# Altium project MainBoard.PrjPCB
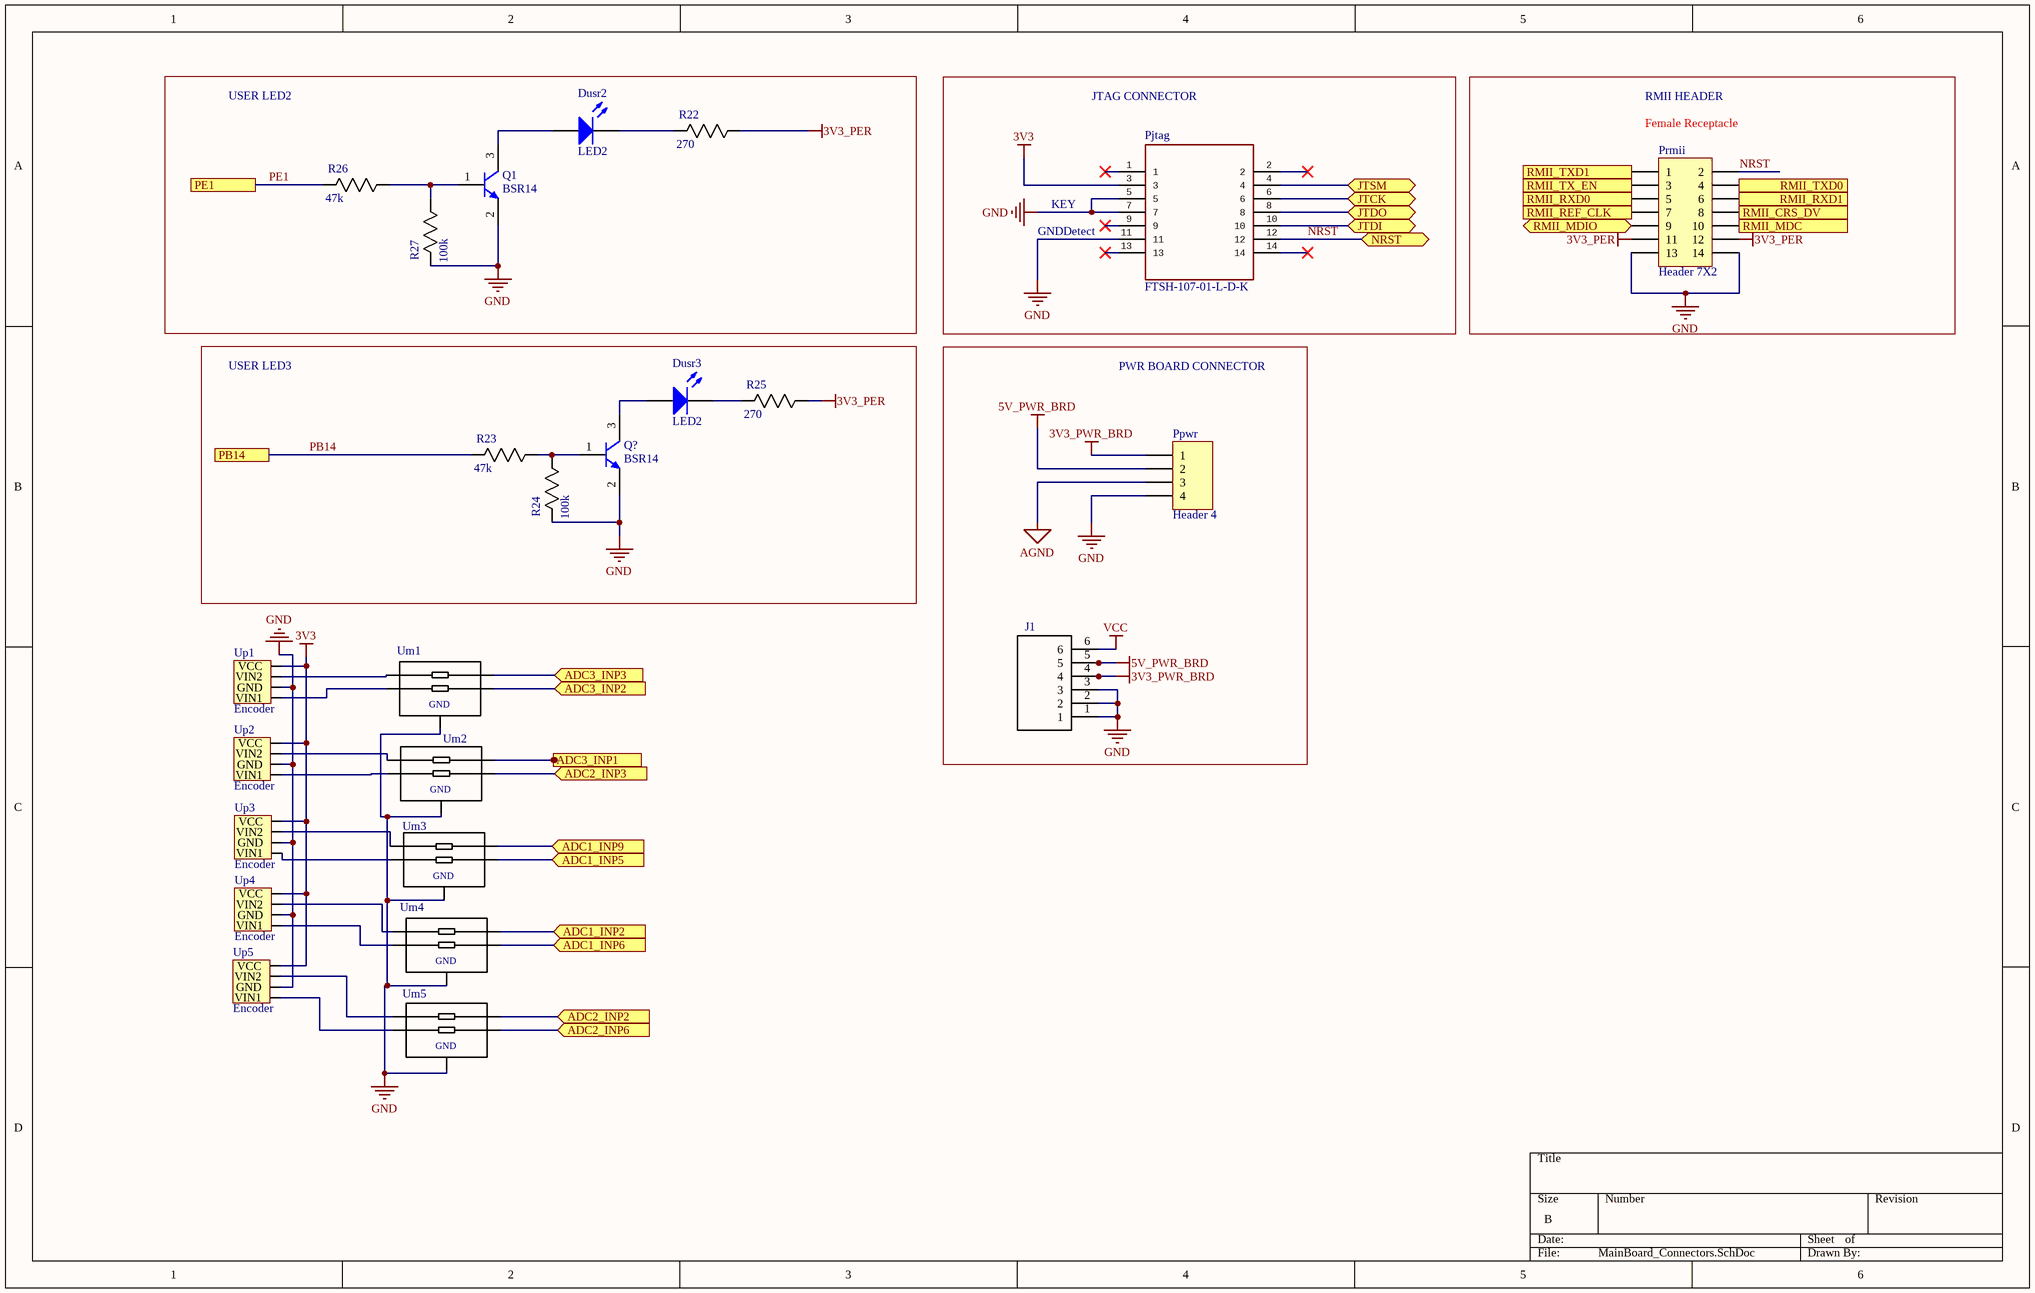
[diagram p0: MainBoard_Connectors.SchDoc]
5 sheets, 105 parts. Net scope: flat (ports and power ports of the same name join across sheets).
Board file: MainBoard.PcbDoc
Sheets:
  MainBoard_Connectors.SchDoc
  MainBoard_Top.SchDoc
    U_MCUIOs = MainBoard_144_IOs.SchDoc
    U_MCU_PWR = MainBoard_MCU_PWR.SchDoc
  MainBoard_USB.SchDoc

## Sheet MainBoard_Connectors.SchDoc
size B

### Parts
Dusr2  LED2  [3.2X1.6X1.1]
Dusr3  LED2  [3.2X1.6X1.1]
J1  CN HEADER VERT 6POS 3.96MM  [CN HDR 6POS 3.96MM]  (value not drawn)
Pjtag  FTSH-107-01-L-D-K  [CN HDR JTAG]
Ppwr  Header 4  [HDR1X4]
Prmii  Header 7X2  [HDR2X7]
Q1  BSR14  [ONSC-SOT-23-3-318-08_V]
Q?  BSR14  [ONSC-SOT-23-3-318-08_V]
R22  270  [0805]
R23  47k  [0805]
R24  100k  [0805]
R25  270  [0805]
R26  47k  [0805]
R27  100k  [0805]
Um1  EMI  [SOT-665]  (value not drawn)
Um2  EMI  [SOT-665]  (value not drawn)
Um3  EMI  [SOT-665]  (value not drawn)
Um4  EMI  [SOT-665]  (value not drawn)
Um5  EMI  [SOT-665]  (value not drawn)
Up1  Encoder  [EncoderConnector]
Up2  Encoder  [EncoderConnector]
Up3  Encoder  [EncoderConnector]
Up4  Encoder  [EncoderConnector]
Up5  Encoder  [EncoderConnector]

### Blocks framed on the sheet
USER LED2: Dusr2 Q1 R22 R26 R27
USER LED3: Dusr3 Q? R23-R25
PWR BOARD CONNECTOR: J1 Ppwr

### Ports
ADC1_INP2 (in), ADC1_INP5 (in), ADC1_INP6 (in), ADC1_INP9 (in), ADC2_INP2 (in), ADC2_INP3 (in), ADC2_INP6 (in), ADC3_INP1 (in), ADC3_INP2 (in), ADC3_INP3 (in), JTCK (bidir), JTDI (bidir), JTDO (bidir), JTSM (bidir), NRST (bidir), PB14, PE1, RMII_CRS_DV (out), RMII_MDC (in), RMII_MDIO (bidir), RMII_REF_CLK (in), RMII_RXD0 (out), RMII_RXD1 (out), RMII_TX_EN (in), RMII_TXD0 (in), RMII_TXD1 (in)

### Nets
3V3: Pjtag.3 Up1.VCC Up2.VCC Up3.VCC Up4.VCC Up5.VCC
3V3_PER: Prmii.11 Prmii.12 R22.1(R1) R25.1(R1)
3V3_PWR_BRD: J1.4 Ppwr.1
5V_PWR_BRD: J1.5 Ppwr.2
AGND: Ppwr.3
GND: J1.1 J1.2 J1.3 Pjtag.5 Pjtag.7 Pjtag.11 Ppwr.4 Prmii.13 Prmii.14 Q1.2(E) Q?.2(E) R24.2(R2) R27.2(R2) Um1.2(P$2) Um2.2(P$2) Um3.2(P$2) Um4.2(P$2) Um5.2(P$2) Up1.GND Up2.GND Up3.GND Up4.GND Up5.GND
VCC: J1.6
ADC1_INP2: Um4.5(P$5) ; port ADC1_INP2
ADC1_INP5: Um3.4(P$4) ; port ADC1_INP5
ADC1_INP6: Um4.4(P$4) ; port ADC1_INP6
ADC1_INP9: Um3.5(P$5) ; port ADC1_INP9
ADC2_INP2: Um5.5(P$5) ; port ADC2_INP2
ADC2_INP3: Um2.4(P$4) ; port ADC2_INP3
ADC2_INP6: Um5.4(P$4) ; port ADC2_INP6
ADC3_INP1: Um2.5(P$5) ; port ADC3_INP1
ADC3_INP2: Um1.4(P$4) ; port ADC3_INP2
ADC3_INP3: Um1.5(P$5) ; port ADC3_INP3
ETH_CRS_DV: Prmii.8 ; port RMII_CRS_DV
ETH_MDC: Prmii.10 ; port RMII_MDC
ETH_MDIO: Prmii.9 ; port RMII_MDIO
ETH_REF_CLK: Prmii.7 ; port RMII_REF_CLK
ETH_RXD0: Prmii.5 ; port RMII_RXD0
ETH_RXD1: Prmii.6 ; port RMII_RXD1
ETH_TX_EN: Prmii.3 ; port RMII_TX_EN
ETH_TXD0: Prmii.4 ; port RMII_TXD0
ETH_TXD1: Prmii.1 ; port RMII_TXD1
JTCK-SWCLK: Pjtag.6 ; port JTCK
JTDI: Pjtag.10 ; port JTDI
JTDO_SWO: Pjtag.8 ; port JTDO
NRST: Pjtag.12 Prmii.2 ; port NRST
PB14: R23.2(R2) ; port PB14
PE1: R26.2(R2) ; port PE1
NetDusr2_1: Dusr2.1(A) Q1.3(C)
NetDusr2_2: Dusr2.2(K) R22.2(R2)
NetDusr3_1: Dusr3.1(A) Q?.3(C)
NetDusr3_2: Dusr3.2(K) R25.2(R2)
NetPjtag_4: Pjtag.4 ; port JTSM
NetQ1_1: Q1.1(B) R26.1(R1) R27.1(R1)
NetQ?_1: Q?.1(B) R23.1(R1) R24.1(R1)
NetUm1_1: Um1.1(P$1) Up1.VIN2
NetUm1_3: Um1.3(P$3) Up1.VIN1
NetUm2_1: Um2.1(P$1) Up2.VIN2
NetUm2_3: Um2.3(P$3) Up2.VIN1
NetUm3_1: Um3.1(P$1) Up3.VIN2
NetUm3_3: Um3.3(P$3) Up3.VIN1
NetUm4_1: Um4.1(P$1) Up4.VIN2
NetUm4_3: Um4.3(P$3) Up4.VIN1
NetUm5_1: Um5.1(P$1) Up5.VIN2
NetUm5_3: Um5.3(P$3) Up5.VIN1

Not connected (* = marked no-connect by the designer): Pjtag 1* 2* 9* 13* 14*

### Notes on the sheet
- JTAG CONNECTOR
- RMII HEADER
- (near Prmii) Female Receptacle
- (near Pjtag) GNDDetect
- KEY
- (in symbol IP4256CZ5-W) GND

### Library data of the parts
Dusr2 = LED GREEN SMD: Typical RED, GREEN, YELLOW, AMBER GaAs LED; MF: Lite-On Inc.; MP: LTST-C191KGKT; Rating: 2V; Digikey: 160-1446-1-ND; Digikey Link: https://www.digikey.ca/products/en?keywords=160-1446-1-ND; Package: 0603
Dusr3 = LED RED SMD: Typical RED, GREEN, YELLOW, AMBER GaAs LED; MF: Lite-On Inc.; MP: LTST-C190CKT; Rating: 1.8V; Digikey: 160-1181-1-ND; Digikey Link: https://www.digikey.ca/products/en?keywords=160-1181-1-ND; Package: 0603
J1 = CN HDR VERT 6POS 3.96MM: Connector Header Through Hole 6 position 0.156" (3.96mm); MF: TE Connectivity; MP: 1877285-6; Current Rating: 7.5A; Voltage Rating: 250VAC; SnapEDA_Link: https://www.snapeda.com/parts/1877285-6/TE%20Connectivity/view-part/2371244/?ref=snap; Digikey: A99849-ND; Digikey Link: https://www.digikey.ca/product-detail/en/te-connectivity-amp-connectors/1877285-6/A99849-ND/2000097
Pjtag = CN HDR JTAG: Connector Header Through Hole 14 position 0.050" (1.27mm); MF: Samtec Inc.; Rating: 3.4A; ComponentLink1Description: Digikey; ComponentLink1URL: https://www.digikey.ca/product-detail/en/samtec-inc/FTSH-107-01-L-D-K/612-FTSH-107-01-L-D-K-ND/6693516; ComponentLink2Description: Datasheet; ComponentLink2URL: https://www.digikey.ca/en/datasheets/samtecinc/samtec-inc-ftsh-1xx-xx-xx-d-xx-xx-mkt; Digikey: 612-FTSH-107-01-L-D-K-ND; Digikey Link: https://www.digikey.ca/product-detail/en/samtec-inc/FTSH-107-01-L-D-K/612-FTSH-107-01-L-D-K-ND/6693516; MP: FTSH-107-01-L-D-K; Price: 5.14000 CAD
Ppwr = Header 4: Header, 4-Pin; LatestRevisionDate: 17-Jul-2002; LatestRevisionNote: Re-released for DXP Platform.; Publisher: Altium Limited
Prmii = Header 7X2: Header, 7-Pin, Dual row; LatestRevisionDate: 17-Jul-2002; LatestRevisionNote: Re-released for DXP Platform.; Publisher: Altium Limited
Q1 Q? = CMP-1048-00605-1: Bipolar (BJT) Transistor NPN 40V 800mA 300MHz 350mW Surface Mount SOT-23-3; ComponentLink1Description: Manufacturer URL; ComponentLink3Description: Package Specification; ComponentLink2URL: http://www.onsemi.com/pub_link/Collateral/BSS64LT1-D.PDF; ComponentLink1URL: http://www.onsemi.com/; ComponentLink2Description: Datasheet; ComponentLink3URL: http://www.onsemi.cn/pub_link/Collateral/318-08.PDF; Digikey: BSR14TR-ND
R22 R25 = RES 270 0805: RES SMD 270 OHM 5% 1/8W 0805; MP: RC0805JR-07270RL; MF: Yageo; Rating: 0.125W; Digikey: 311-270ARCT-ND; Price: 0.054 CAD; Package: 0805; Value: 270; Digikey Link: https://www.digikey.ca/product-detail/en/yageo/RC0805JR-07270RL/311-270ARCT-ND/731238
R23 R26 = RES 47k 0805: RES SMD 47K OHM 1% 1/8W 0805; MP: RC0805FR-0747KL; MF: Yageo; Rating: 0.125W; Digikey: 311-47.0KCRCT-ND; Price: 0.061 CAD; Package: 0805; Value: 47k; Digikey Link: https://www.digikey.ca/product-detail/en/yageo/RC0805FR-0747KL/311-47.0KCRCT-ND/730920; Tolerance: 1%
R24 R27 = RES 100k 0805: RES SMD 100K OHM 1% 1/8W 0805; MP: RC0805FR-07100KL; MF: Yageo; Rating: 0.125W; Digikey: 311-100KCRCT-ND; Price: 0.058 CAD; Package: 0805; Value: 100k; Digikey Link: https://www.digikey.ca/products/en?keywords=311-100KCRCT-ND; Tolerance: 1%
Um1-Um5 = IP4256CZ5-W: RC (Pi) EMI Filter 2nd Order Low Pass 2 Channel R = 100Ohms, C = 19pF (Total)  SOT-665; MF: Nexperia USA Inc.; MP: IP4256CZ5-W,115; SnapEDA_Link: https://www.snapeda.com/parts/IP4256CZ5-W/Nexperia%20USA%20Inc./view-part/3605439/?ref=snap; Price: 0.17 CAD; Package: SOT-665; Digikey: 1727-4718-1-ND; Digikey Link: https://www.digikey.ca/product-detail/en/nexperia-usa-inc/IP4256CZ5-W115/1727-4718-1-ND/2531158
Up1-Up5 = Encoder Connector: CONN HEADER R/A 4POS 1.5MM; MF: JST Sales America Inc.; MP: S4B-ZR(LF)(SN); Rating: 1A; Digikey: 455-1671-ND; Digikey Link: https://www.digikey.ca/products/en?keywords=455-1671-ND; Price: 0.324 CAD; Package: N/A; Value: N/A

## Sheet MainBoard_Top.SchDoc
size A
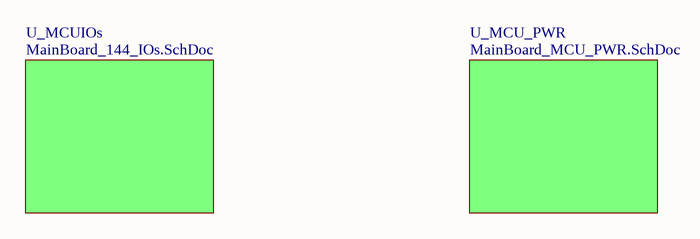
[diagram p1: MainBoard_Top.SchDoc]

### Sub-sheets
U_MCU_PWR = MainBoard_MCU_PWR.SchDoc: no entries
U_MCUIOs = MainBoard_144_IOs.SchDoc: no entries

## Sheet MainBoard_144_IOs.SchDoc
size B
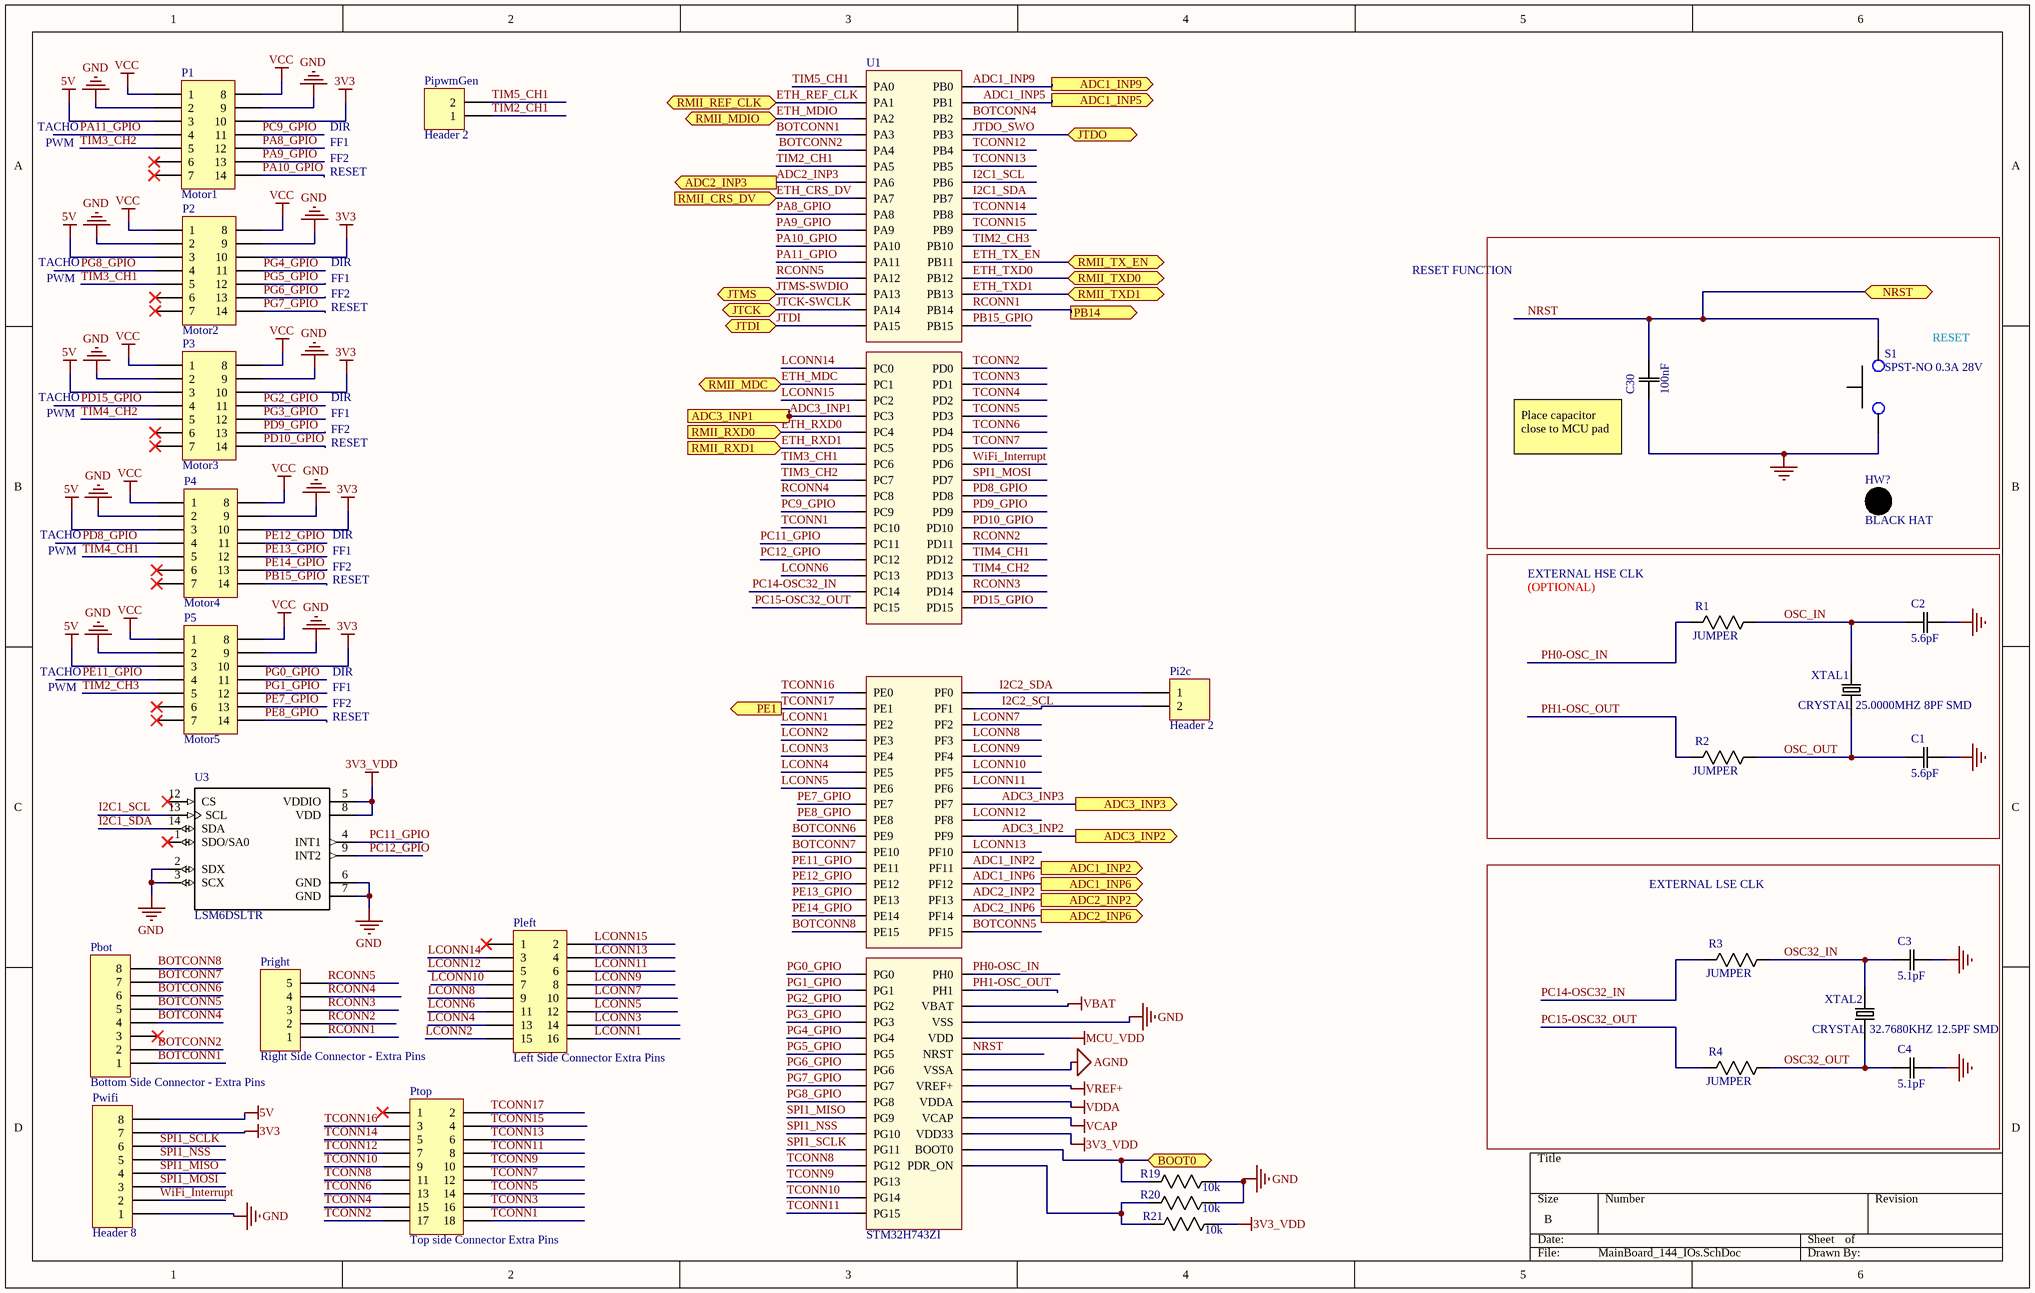
[diagram p2: MainBoard_144_IOs.SchDoc]

### Parts
C1  5.6pF  [0805]
C2  5.6pF  [0805]
C3  5.1pF  [0805]
C4  5.1pF  [0805]
C30  100nF  [0805]
HW?  value BLACK HAT  (hidden comment: BUTTON_HAT_BLACK)  (mechanical)
P1  Motor1  [HDR2X7_CEN]
P2  Motor2  [HDR2X7_CEN]
P3  Motor3  [HDR2X7_CEN]
P4  Motor4  [HDR2X7_CEN]
P5  Motor5  [HDR2X7_CEN]
Pbot  Bottom Side Connector - Extra Pins  [HDR1X8]
Pi2c  Header 2  [HDR1X2]
PipwmGen  Header 2  [HDR1X2]
Pleft  Left Side Connector Extra Pins  [HDR2X8]
Pright  Right Side Connector - Extra Pins  [HDR1X5]
Ptop  Top side Connector Extra Pins  [HDR2X9]
Pwifi  Header 8  [HDR1X8]
R1  JUMPER  [0805]
R2  JUMPER  [0805]
R3  JUMPER  [0805]
R4  JUMPER  [0805]
R19  10k  [0805]
R20  10k  [0805]
R21  10k  [0805]
S1  SPST-NO 0.3A 28V  [PB300STQ]
U1  STM32H743ZI  [STM32H7]
U3  LSM6DSLTR  [LGA-14]
XTAL1  CRYSTAL 25.0000MHZ 8PF SMD  [SMD-2]
XTAL2  CRYSTAL 32.7680KHZ 12.5PF SMD  [SMD-2]

### Blocks framed on the sheet
EXTERNAL LSE CLK: C3 C4 R3 R4 XTAL2

### Ports
ADC1_INP2 (out), ADC1_INP5 (out), ADC1_INP6 (out), ADC1_INP9 (out), ADC2_INP2 (out), ADC2_INP3 (out), ADC2_INP6 (out), ADC3_INP1 (out), ADC3_INP2 (out), ADC3_INP3 (out), BOOT0 (bidir), JTCK (bidir), JTDI (bidir), JTDO (bidir), JTMS (bidir), NRST (bidir), PB14 (out), PE1 (out), RMII_CRS_DV (in), RMII_MDC (bidir), RMII_MDIO (bidir), RMII_REF_CLK (bidir), RMII_RXD0 (in), RMII_RXD1 (in), RMII_TX_EN (bidir), RMII_TXD0 (bidir), RMII_TXD1 (bidir)

### Nets
3V3: P1.10 P2.10 P3.10 P4.10 P5.10 Pwifi.7
3V3_VDD: R21.1(R1) U1.VDD33USB(VDD33) U3.5(VDDIO) U3.8(VDD)
5V: P1.3 P2.3 P3.3 P4.3 P5.3 Pwifi.8
AGND: U1.VSSA
GND: C1.2(C2) C2.2(C2) C3.2(C2) C4.2(C2) C30.1(C1) P1.2 P1.9 P2.2 P2.9 P3.2 P3.9 P4.2 P4.9 P5.2 P5.9 Pwifi.1 R19.1(R1) R20.1(R1) S1.1 U1.VSS U3.2(SDX) U3.3(SCX) U3.6(GND) U3.7(GND)
MCU_VDD: U1.VDD
VBAT: U1.VBAT
VCAP: U1.VCAP
VCC: P1.1 P1.8 P2.1 P2.8 P3.1 P3.8 P4.1 P4.8 P5.1 P5.8
VDDA: U1.VDDA
VREF+: U1.VREF+
ADC1_INP2: U1.PF11 ; port ADC1_INP2
ADC1_INP5: U1.PB1 ; port ADC1_INP5
ADC1_INP6: U1.PF12 ; port ADC1_INP6
ADC1_INP9: U1.PB0 ; port ADC1_INP9
ADC2_INP2: U1.PF13 ; port ADC2_INP2
ADC2_INP3: U1.PA6 ; port ADC2_INP3
ADC2_INP6: U1.PF14 ; port ADC2_INP6
ADC3_INP1: U1.PC3 ; port ADC3_INP1
ADC3_INP2: U1.PF9 ; port ADC3_INP2
ADC3_INP3: U1.PF7 ; port ADC3_INP3
BOTCONN1: Pbot.1 U1.PA3
BOTCONN2: Pbot.2 U1.PA4
BOTCONN4: Pbot.4 U1.PB2
BOTCONN5: Pbot.5 U1.PF15
BOTCONN6: Pbot.6 U1.PE9
BOTCONN7: Pbot.7 U1.PE10
BOTCONN8: Pbot.8 U1.PE15
ETH_CRS_DV: U1.PA7 ; port RMII_CRS_DV
ETH_MDC: U1.PC1 ; port RMII_MDC
ETH_MDIO: U1.PA2 ; port RMII_MDIO
ETH_REF_CLK: U1.PA1 ; port RMII_REF_CLK
ETH_RXD0: U1.PC4 ; port RMII_RXD0
ETH_RXD1: U1.PC5 ; port RMII_RXD1
ETH_TX_EN: U1.PB11 ; port RMII_TX_EN
ETH_TXD0: U1.PB12 ; port RMII_TXD0
ETH_TXD1: U1.PB13 ; port RMII_TXD1
I2C1_SCL: U1.PB6 U3.13(SCL)
I2C1_SDA: U1.PB7 U3.14(SDA)
I2C2_SCL: Pi2c.2 U1.PF1
I2C2_SDA: Pi2c.1 U1.PF0
JTCK-SWCLK: U1.PA14 ; port JTCK
JTDI: U1.PA15 ; port JTDI
JTDO_SWO: U1.PB3 ; port JTDO
JTMS-SWDIO: U1.PA13 ; port JTMS
LCONN1: Pleft.16 U1.PE2
LCONN2: Pleft.15 U1.PE3
LCONN3: Pleft.14 U1.PE4
LCONN4: Pleft.13 U1.PE5
LCONN5: Pleft.12 U1.PE6
LCONN6: Pleft.11 U1.PC13
LCONN7: Pleft.10 U1.PF2
LCONN8: Pleft.9 U1.PF3
LCONN9: Pleft.8 U1.PF4
LCONN10: Pleft.7 U1.PF5
LCONN11: Pleft.6 U1.PF6
LCONN12: Pleft.5 U1.PF8
LCONN13: Pleft.4 U1.PF10
LCONN14: Pleft.3 U1.PC0
LCONN15: Pleft.2 U1.PC2
NRST: C30.2(C2) S1.2 U1.NRST ; port NRST
OSC32_IN: C3.1(C1) R3.1(R1) XTAL2.2
OSC32_OUT: C4.1(C1) R4.1(R1) XTAL2.1
OSC_IN: C2.1(C1) R1.1(R1) XTAL1.2
OSC_OUT: C1.1(C1) R2.1(R1) XTAL1.1
PA8_GPIO: P1.12 U1.PA8
PA9_GPIO: P1.13 U1.PA9
PA10_GPIO: P1.14 U1.PA10
PA11_GPIO: P1.4 U1.PA11
PB15_GPIO: P4.14 U1.PB15
PC9_GPIO: P1.11 U1.PC9
PC11_GPIO: U1.PC11 U3.4(INT1)
PC12_GPIO: U1.PC12 U3.9(INT2)
PC14-OSC32_IN: R3.2(R2) U1.PC14
PC15-OSC32_OUT: R4.2(R2) U1.PC15
PD8_GPIO: P4.4 U1.PD8
PD9_GPIO: P3.13 U1.PD9
PD10_GPIO: P3.14 U1.PD10
PD15_GPIO: P3.4 U1.PD15
PE7_GPIO: P5.13 U1.PE7
PE8_GPIO: P5.14 U1.PE8
PE11_GPIO: P5.4 U1.PE11
PE12_GPIO: P4.11 U1.PE12
PE13_GPIO: P4.12 U1.PE13
PE14_GPIO: P4.13 U1.PE14
PG0_GPIO: P5.11 U1.PG0
PG1_GPIO: P5.12 U1.PG1
PG2_GPIO: P3.11 U1.PG2
PG3_GPIO: P3.12 U1.PG3
PG4_GPIO: P2.11 U1.PG4
PG5_GPIO: P2.12 U1.PG5
PG6_GPIO: P2.13 U1.PG6
PG7_GPIO: P2.14 U1.PG7
PG8_GPIO: P2.4 U1.PG8
PH0-OSC_IN: R1.2(R2) U1.PH0
PH1-OSC_OUT: R2.2(R2) U1.PH1
RCONN1: Pright.1 U1.PB14 ; port PB14  [project net PB14]
RCONN2: Pright.2 U1.PD11
RCONN3: Pright.3 U1.PD14
RCONN4: Pright.4 U1.PC8
RCONN5: Pright.5 U1.PA12
SPI1_MISO: Pwifi.4 U1.PG9
SPI1_MOSI: Pwifi.3 U1.PD7
SPI1_NSS: Pwifi.5 U1.PG10
SPI1_SCLK: Pwifi.6 U1.PG11
TCONN1: Ptop.18 U1.PC10
TCONN2: Ptop.17 U1.PD0
TCONN3: Ptop.16 U1.PD1
TCONN4: Ptop.15 U1.PD2
TCONN5: Ptop.14 U1.PD3
TCONN6: Ptop.13 U1.PD4
TCONN7: Ptop.12 U1.PD5
TCONN8: Ptop.11 U1.PG12
TCONN9: Ptop.10 U1.PG13
TCONN10: Ptop.9 U1.PG14
TCONN11: Ptop.8 U1.PG15
TCONN12: Ptop.7 U1.PB4
TCONN13: Ptop.6 U1.PB5
TCONN14: Ptop.5 U1.PB8
TCONN15: Ptop.4 U1.PB9
TCONN16: Ptop.3 U1.PE0
TCONN17: Ptop.2 U1.PE1 ; port PE1  [project net PE1]
TIM2_CH1: PipwmGen.1 U1.PA5
TIM2_CH3: P5.5 U1.PB10
TIM3_CH1: P2.5 U1.PC6
TIM3_CH2: P1.5 U1.PC7
TIM4_CH1: P4.5 U1.PD12
TIM4_CH2: P3.5 U1.PD13
TIM5_CH1: PipwmGen.2 U1.PA0
WiFi_Interrupt: Pwifi.2 U1.PD6
NetR19_2: R19.2(R2) U1.BOOT0 ; port BOOT0
NetR20_2: R20.2(R2) R21.2(R2) U1.PDR_ON

Not connected (* = marked no-connect by the designer): P1 6* 7*; P2 6* 7*; P3 6* 7*; P4 6* 7*; P5 6* 7*; Pbot 3*; Pleft 1*; Ptop 1*; U3 1(SDO/SA0)* 12(CS)*

### Notes on the sheet
- TACHO
- PWM
- DIR
- FF1
- FF2
- RESET
- RESET FUNCTION
- (near C30) Place capacitor close to MCU pad
- EXTERNAL HSE CLK
- (OPTIONAL)

### Library data of the parts
C1 C2 = CAP 5.6pF 0805: CAP CER 5.6PF 50V C0G/NP0 0805; MP: C0805C569D5GACTU; MF: KEMET; Tolerance: 5%; Package: 0805; Price: 0,249 CAD; Value: 5.6pF; Digikey: 399-9261-1-ND; Digikey Link: https://www.digikey.ca/product-detail/en/kemet/C0805C569D5GACTU/399-9261-1-ND/3522779; Rating: 50V
C3 C4 = CAP 5.1pF 0805: CAP CER 5.1PF 630V NP0 0805; MP: C0805C519KBGAC7800; MF: KEMET; Tolerance: 10%; Rating: 50V; Package: 0805; Price: 0,493 CAD; Value: 5.1pF; Digikey: 399-16524-1-ND; Digikey Link: https://www.digikey.ca/product-detail/en/kemet/C0805C519KBGAC7800/399-16524-1-ND/7917337
C30 = CAP 100nF 0805: CAP CER 0.1UF 50V X7R 0805; MP: CC0805KRX7R9BB104; MF: Yageo; Tolerance: 10%; Package: 0805; Price: 0,119 CAD; Value: 100nF; Digikey: 311-1140-1-ND; Digikey Link: https://www.digikey.ca/products/en?keywords=311-1140-1-ND; Rating: 50V
HW? = MCD-00635: Black Hat for switch TD0341X-G01-BLA; Part_Type: Mechanical; Manufacturer_Part_Number: 988.16.09.3.00003_SH-517; Manufacturer: JIUBABA; Provided_By: SUBCO; Internal_Part_Number: MCD-00635; Status: Released; ComponentLink1Description: Datasheet; ComponentLink1URL: http://tunmcdsvn.tun.st.com/Component_Datasheet_Library/Trunk/Mechanical/Jiubaba_HAT_SH-517; ECCN_US: n/a; ECCN_EU: n/a
P1-P5 = Header 7X2A: Header, 7-Pin, Dual row; LatestRevisionDate: 17-Jul-2002; LatestRevisionNote: Re-released for DXP Platform.; Publisher: Altium Limited
Pbot Pwifi = Header 8: Header, 8-Pin; LatestRevisionDate: 17-Jul-2002; LatestRevisionNote: Re-released for DXP Platform.; Publisher: Altium Limited
Pi2c PipwmGen = Header 2: Header, 2-Pin; LatestRevisionDate: 17-Jul-2002; LatestRevisionNote: Re-released for DXP Platform.; Publisher: Altium Limited
Pleft = Header 8X2: Header, 8-Pin, Dual row; LatestRevisionDate: 17-Jul-2002; LatestRevisionNote: Re-released for DXP Platform.; Publisher: Altium Limited
Pright = Header 5: Header, 5-Pin; LatestRevisionDate: 17-Jul-2002; LatestRevisionNote: Re-released for DXP Platform.; Publisher: Altium Limited
Ptop = Header 9X2: Header, 9-Pin, Dual row; LatestRevisionDate: 17-Jul-2002; LatestRevisionNote: Re-released for DXP Platform.; Publisher: Altium Limited
R1-R4 = RES 0 0805: RES SMD 0 OHM JUMPER 1/8W 0805; MP: RC0805JR-070RL; MF: Yageo; Value: 0; Rating: 0.125W; Digikey: 311-0.0ARCT-ND; Price: 0.058 CAD; Package: 0805; Digikey Link: https://www.digikey.ca/products/en?keywords=311-0.0ARCT-ND
R19-R21 = RES 10k 0805: RES SMD 10K OHM 1% 1/8W 0805; MP: RC0805FR-0710KL; MF: Yageo; Rating: 0.125W; Digikey: 311-10.0KCRCT-ND; Price: 0.061 CAD; Package: 0805; Value: 10k; Digikey Link: https://www.digikey.ca/products/en?keywords=311-10.0KCRCT-ND; Tolerance: 1%
S1 = SW PUSH NO: Pushbutton Switch SPST-NO Standard Through Hole; MF: E-Switch; Rating: 28V 0.3A; ComponentLink1Description: Digikey; ComponentLink1URL: https://www.digikey.ca/product-detail/en/e-switch/PB300STQ/EG5398-ND/6126493; ComponentLink2Description: Datasheet; ComponentLink2URL: https://sten-eswitch-13110800-production.s3.amazonaws.com/system/asset/product_line/data_sheet/222/PB300.pdf; Digikey: EG5398-ND; Digikey Link: https://www.digikey.ca/product-detail/en/e-switch/PB300STQ/EG5398-ND/6126493; MP: PB300STQ; Price: 3.40000 CAD
U1 = STM32H743ZI: MF: STMicroelectronics; MP: STM32H743ZIT6; Digikey: 497-17721-ND; Digikey Link: https://www.digikey.ca/product-detail/en/stmicroelectronics/STM32H743ZIT6/497-17721-ND/7809238; Package: 144-LQFP (20x20)
U3 = LSM6DSLTR: Accelerometer, Gyroscope, Temperature, 6 Axis Sensor IÂ²C, SPI Output; MF: STMicroelectronics; SnapEDA_Link: https://www.snapeda.com/parts/LSM6DSLTR/STMicroelectronics/view-part/550517/?ref=snap; Price: None; Availability: Unavailable; MP: LSM6DSLTR; Package: LGA-14 STMicroelectronics; Value: *
XTAL1 = XTAL 25MHZ 8PF SMD: 25MHz ±50ppm Crystal 8pF 70 Ohms 2-SMD, No Lead; MP: NX5032GA-25.000000MHZ-LN-CD-1; MF: NDK America, Inc.; ESR: 70 Ohms; Package: 2-SMD, No Lead; Price: 0.95 CAD; Frequency: 25MHz; Digikey: 644-1041-1-ND; Digikey Link: https://www.digikey.ca/product-detail/en/ndk-america-inc/NX5032GA-25.000000MHZ-LN-CD-1/644-1041-1-ND/1128913; Load Capacitance: 8pF
XTAL2 = XTAL 32.7680KHZ 12.5PF SMD: 32.768kHz ±20ppm Crystal 12.5pF 70 kOhms 2-SMD, No Lead; MP: NX3215SA-32.768K-STD-MUA-8; MF: NDK America, Inc.; Package: 2-SMD, No Lead; Price: 1.04000 CAD; Frequency: 32.768kHz; Digikey: 644-1156-1-ND; Digikey Link: https://www.digikey.ca/en/products/detail/ndk-america-inc/NX3215SA-32-768K-STD-MUA-8/2261469?s=N4IgTCBcDaIGwBYEFoCMqCsc3IHIBEQBdAXyA; Load Capacitance: 12.5pF; ESR: 70 kOhms; ComponentLink1Description: Digikey; ComponentLink1URL: https://www.digikey.ca/en/products/detail/ndk-america-inc/NX3215SA-32-768K-STD-MUA-8/2261469; ComponentLink2Description: Datasheet; ComponentLink2URL: https://media.digikey.com/datasheets/production/702868/1/NX3215SA-32-768K-STD-MUA-8.html

## Sheet MainBoard_MCU_PWR.SchDoc
size B
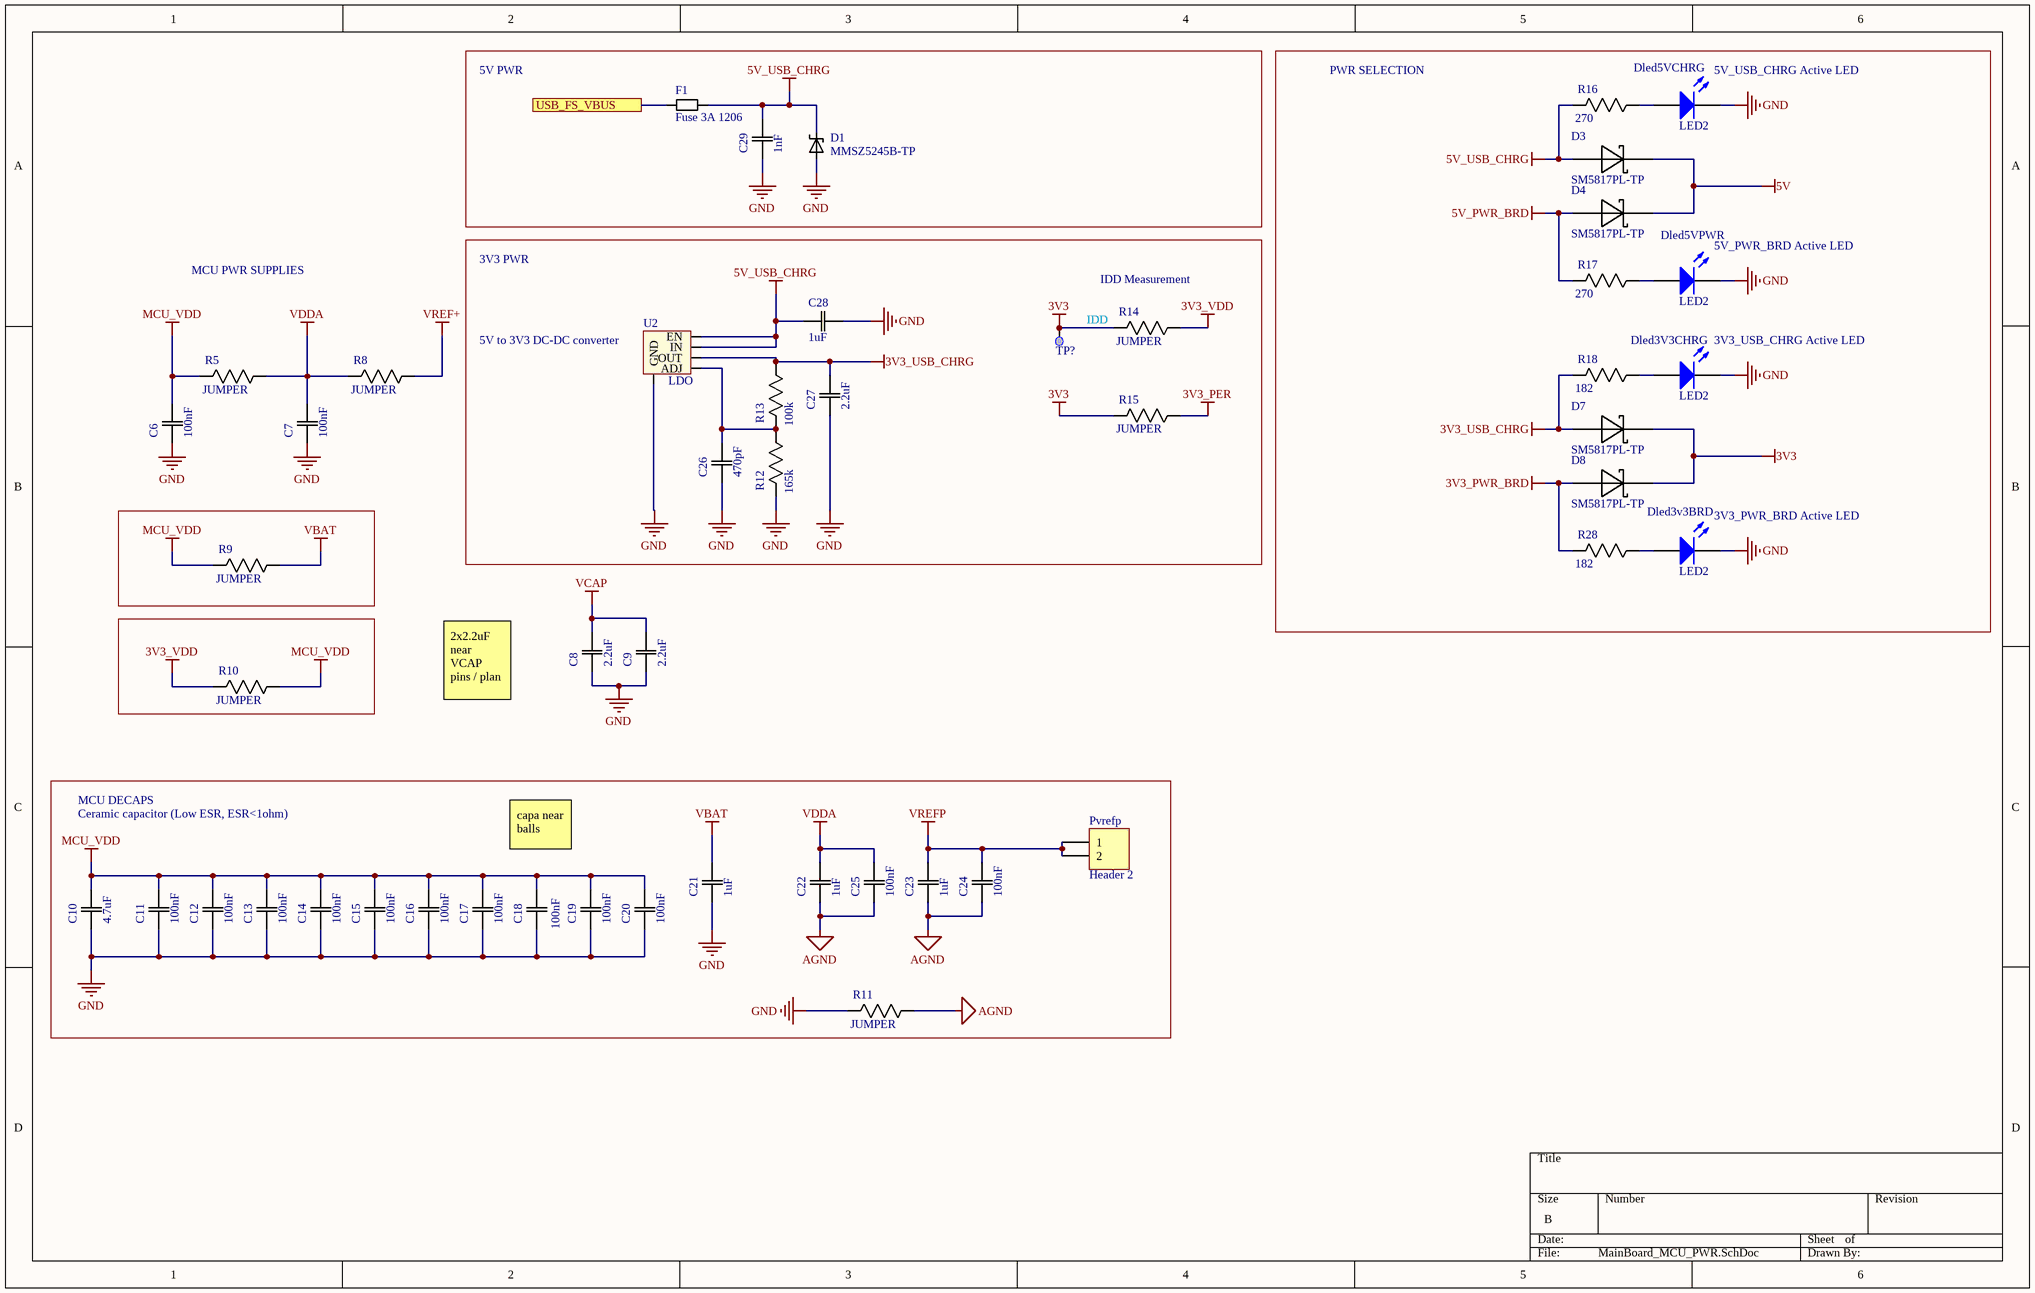
[diagram p3: MainBoard_MCU_PWR.SchDoc]

### Parts
C6  100nF  [0805]
C7  100nF  [0805]
C8  2.2uF  [0805]
C9  2.2uF  [0805]
C10  4.7uF  [0805]
C11  100nF  [0805]
C12  100nF  [0805]
C13  100nF  [0805]
C14  100nF  [0805]
C15  100nF  [0805]
C16  100nF  [0805]
C17  100nF  [0805]
C18  100nF  [0805]
C19  100nF  [0805]
C20  100nF  [0805]
C21  1uF  [0805]
C22  1uF  [0805]
C23  1uF  [0805]
C24  100nF  [0805]
C25  100nF  [0805]
C26  470pF  [0805]
C27  2.2uF  [0805]
C28  1uF  [0805]
C29  1nF  [0805]
D1  MMSZ5245B-TP  [SOD-123]
D3  SM5817PL-TP  [SOD-123]
D4  SM5817PL-TP  [SOD-123]
D7  SM5817PL-TP  [SOD-123]
D8  SM5817PL-TP  [SOD-123]
Dled3v3BRD  LED2  [3.2X1.6X1.1]
Dled3V3CHRG  LED2  [3.2X1.6X1.1]
Dled5VCHRG  LED2  [3.2X1.6X1.1]
Dled5VPWR  LED2  [3.2X1.6X1.1]
F1  Fuse 3A 1206  [1206]
Pvrefp  Header 2  [HDR1X2]
R5  JUMPER  [0805]
R8  JUMPER  [0805]
R9  JUMPER  [0805]
R10  JUMPER  [0805]
R11  JUMPER  [0805]
R12  165k  [0805]
R13  100k  [0805]
R14  JUMPER  [0805]
R15  JUMPER  [0805]
R16  270  [0805]
R17  270  [0805]
R18  182  [0805]
R28  182  [0805]
TP?  Test Point  [TP_SMD_1MM]  (value not drawn)  (no BOM)
U2  LDO  [REG LIN POS ADJ 500MA 8SOIC]

### Blocks framed on the sheet
5V PWR: C29 D1 F1

### Ports
USB_FS_VBUS

### Nets
3V3: D7.C(K) D8.C(K) R14.2(R2) R15.2(R2) TP?.1
3V3_PER: R15.1(R1)
3V3_PWR_BRD: D8.A R28.2(R2)
3V3_USB_CHRG: C27.2(C2) D7.A R13.1(R1) R18.2(R2) U2.OUT
3V3_VDD: R10.2(R2) R14.1(R1)
5V: D3.C(K) D4.C(K)
5V_PWR_BRD: D4.A R17.2(R2)
5V_USB_CHRG: C28.1(C1) C29.2(C2) D1.C D3.A F1.2 R16.2(R2) U2.EN U2.IN
AGND: C22.1(C1) C23.1(C1) C24.1(C1) C25.1(C1) R11.1(R1)
GND: C6.1(C1) C7.1(C1) C8.1(C1) C9.1(C1) C10.1(C1) C11.1(C1) C12.1(C1) C13.1(C1) C14.1(C1) C15.1(C1) C16.1(C1) C17.1(C1) C18.1(C1) C19.1(C1) C20.1(C1) C21.1(C1) C26.1(C1) C27.1(C1) C28.2(C2) C29.1(C1) D1.A Dled3v3BRD.2(K) Dled3V3CHRG.2(K) Dled5VCHRG.2(K) Dled5VPWR.2(K) R11.2(R2) R12.2(R2) U2.GND
MCU_VDD: C6.2(C2) C10.2(C2) C11.2(C2) C12.2(C2) C13.2(C2) C14.2(C2) C15.2(C2) C16.2(C2) C17.2(C2) C18.2(C2) C19.2(C2) C20.2(C2) R5.2(R2) R9.2(R2) R10.1(R1)
VBAT: C21.2(C2) R9.1(R1)
VCAP: C8.2(C2) C9.2(C2)
VDDA: C7.2(C2) C22.2(C2) C25.2(C2) R5.1(R1) R8.2(R2)
VREF+: R8.1(R1)
VREFP: C23.2(C2) C24.2(C2) Pvrefp.1 Pvrefp.2
NetC26_2: C26.2(C2) R12.1(R1) R13.2(R2) U2.ADJ
NetDled3v3BRD_1: Dled3v3BRD.1(A) R28.1(R1)
NetDled3V3CHRG_1: Dled3V3CHRG.1(A) R18.1(R1)
NetDled5VCHRG_1: Dled5VCHRG.1(A) R16.1(R1)
NetDled5VPWR_1: Dled5VPWR.1(A) R17.1(R1)
NetF1_1: F1.1 ; port USB_FS_VBUS

### Notes on the sheet
- PWR SELECTION
- (near Dled5VCHRG) 5V_USB_CHRG Active LED
- MCU PWR SUPPLIES
- 3V3 PWR
- (near R14) IDD Measurement
- (near Dled5VPWR) 5V_PWR_BRD Active LED
- (near U2) 5V to 3V3 DC-DC converter
- IDD
- (near Dled3V3CHRG) 3V3_USB_CHRG Active LED
- (near Dled3v3BRD) 3V3_PWR_BRD Active LED
- 2x2.2uF near VCAP pins / plan
- MCU DECAPS
- Ceramic capacitor (Low ESR, ESR<1ohm)
- capa near balls

### Library data of the parts
C6 C7 C11-C20 C24 C25 = CAP 100nF 0805: as C30 on sheet MainBoard_144_IOs; Package: 0805; Price: 0,119 CAD; Value: 100nF; Digikey: 311-1140-1-ND; Digikey Link: https://www.digikey.ca/products/en?keywords=311-1140-1-ND; Rating: 50V
C8 C9 C27 = CAP 2.2uF 0805: CAP CER 1UF 50V X7R 0805; MP: C0805C225K4RACTU; MF: KEMET; Tolerance: 10%; Rating: 16V; Package: 0805; Price: 0,461 CAD; Value: 2.2uF; Digikey: 399-3523-1-ND; Digikey Link: https://www.digikey.ca/products/en?keywords=399-3523-1-ND
C10 = CAP 4.7uF 0805: CAP CER 4.7UF 25V X5R 0805; MP: CL21B475KOFNNNE; MF: Samsung Electro-Mechanics; Tolerance: 10%; Rating: 16V; Temperature Coefficient: X7R; Package: 0805; Price: 0,49 CAD; Value: 4.7uF; Digikey: 1276-2873-1-ND; Digikey Link: https://www.digikey.ca/product-detail/en/samsung-electro-mechanics/CL21B475KOFNNNE/1276-2873-1-ND/3890959
C21-C23 C28 = CAP 1uF 0805: CAP CER 1UF 50V X7R 0805; MP: CL21B105KBFNNNE; MF: Samsung Electro-Mechanics; Tolerance: 10%; Package: 0805; Price: 0,172 CAD; Value: 1uF; Digikey: 1276-1029-1-ND; Digikey Link: https://www.digikey.ca/product-detail/en/samsung-electro-mechanics/CL21B105KBFNNNE/1276-1029-1-ND/3889115; Rating: 50V
C26 = CAP 470pF 0805: CAP CER 470PF 50V C0G/NPO 0805; MP: CC0805JRNPO9BN471; MF: Yageo; Tolerance: 5%; Package: 0805; Price: 0,135 CAD; Value: 470pF; Digikey: 311-1119-1-ND; Digikey Link: https://www.digikey.ca/products/en?keywords=311-1119-1-ND; Rating: 50V
C29 = CAP 1nF 0805: CAP CER 1000PF 50V X7R 0805; MP: CC0805KRX7R9BB102; MF: Yageo; Tolerance: 10%; Package: 0805; Price: 0.1 CAD; Value: 1nF; Digikey: 311-1127-1-ND; Digikey Link: https://www.digikey.ca/products/en?keywords=311-1127-1-ND; Rating: 50V
D1 = MMSZ5245B-TP: Zener Diode 15V 500mW ±5% Surface Mount SOD-123; MP: MMSZ5224BT1G; MF: ON Semiconductor; Price: None; SnapEDA_Link: https://www.snapeda.com/parts/MMSZ5224BT1G/ON%20Semiconductor/view-part/230941/?ref=snap; Package: SOD-123 ON Semiconductor; Availability: Unavailable; Value: *; ComponentLink1Description: digikey; ComponentLink1URL: https://www.digikey.ca/en/products/detail/micro-commercial-co/MMSZ5245B-TP/1793206
D3 D4 D7 D8 = SM5817PL-TP: Diode Schottky 20V 1A Surface Mount SOD-123FL; MF: Micro Commercial Co; ComponentLink1Description: digikey; ComponentLink1URL: https://www.digikey.ca/product-detail/en/on-semiconductor/MBR0540T1G/MBR0540T1GOSCT-ND/917967; Digikey: SM5817PL-TPMSCT-ND; Digikey Link: https://www.digikey.ca/product-detail/en/micro-commercial-co/SM5817PL-TP/SM5817PL-TPMSCT-ND/1793410; MP: SM5817PL-TP; Voltage Rating: 20V; Package: SOD-123; Current Rating: 1A
Dled3v3BRD Dled3V3CHRG Dled5VCHRG Dled5VPWR = LED GREEN SMD: as Dusr2 on sheet MainBoard_Connectors; Digikey: 160-1446-1-ND; Digikey Link: https://www.digikey.ca/products/en?keywords=160-1446-1-ND; Package: 0603
F1 = Fuse 3A 1206: FUSE 3.0A 63VAC/DC SLOW 1206; MF: Bel Fuse Inc.; MP: 0685T3000-01; Digikey: 507-1896-6-ND; Rating: 3A; Digikey Link: https://www.digikey.ca/product-detail/en/bel-fuse-inc/0685T3000-01/507-1896-6-ND/4968212
Pvrefp = Header 2: Header, 2-Pin; LatestRevisionDate: 17-Jul-2002; LatestRevisionNote: Re-released for DXP Platform.; Publisher: Altium Limited
R5 R8-R11 R14 R15 = RES 0 0805: as R1 on sheet MainBoard_144_IOs; Digikey: 311-0.0ARCT-ND; Price: 0.058 CAD; Package: 0805; Digikey Link: https://www.digikey.ca/products/en?keywords=311-0.0ARCT-ND
R12 = RES 165k 0805: 165 kOhms ±1% 0.25W, 1/4W Chip Resistor 0805 (2012 Metric) Automotive AEC-Q200, Moisture Resistant Thick Film; MP: RK73H2ATTD1653F; MF: KOA Speer Electronics, Inc.; Digikey: 2019-RK73H2ATTD1653FCT-ND; Price: 0.15 CAD; Package: 0805; Value: 165k; Rating: 0.25W; Digikey Link: https://www.digikey.ca/product-detail/en/koa-speer-electronics-inc/RK73H2ATTD1653F/2019-RK73H2ATTD1653FCT-ND/10235747
R13 = RES 100k 0805: as R24 on sheet MainBoard_Connectors; Digikey: 311-100KCRCT-ND; Price: 0.058 CAD; Package: 0805; Value: 100k; Digikey Link: https://www.digikey.ca/products/en?keywords=311-100KCRCT-ND; Tolerance: 1%
R16 R17 = RES 270 0805: as R22 on sheet MainBoard_Connectors; Digikey: 311-270ARCT-ND; Price: 0.054 CAD; Package: 0805; Value: 270; Digikey Link: https://www.digikey.ca/product-detail/en/yageo/RC0805JR-07270RL/311-270ARCT-ND/731238
R18 R28 = RES 182 0805: RES SMD 182 OHM 1% 1/8W 0805; MP: ERJ-6ENF1820V; MF: Panasonic Electronic Components; Rating: 0.125W; Digikey: P182CCT-ND; Price: 0.15 CAD; Package: 0805; Value: 182; Digikey Link: https://www.digikey.ca/product-detail/en/panasonic-electronic-components/ERJ-6ENF1820V/P182CCT-ND/118743; Tolerance: 1%
TP? = MCD-00074: Test Point 1mm; Part_Type: Mechanical; Internal_Part_Number: MCD-00074; Provided_By: n/a; Status: Released; ComponentLink1Description: Datasheet; ComponentLink1URL: http://na; Manufacturer: n/a; Manufacturer_Part_Number: n/a; ECCN_US: n/a; ECCN_EU: n/a
U2 = REG LIN POS ADJ: Linear Voltage Regulator IC  1 Output  500mA 8-SOIC; MF: Texas Instruments; MP: TL5209DR; Digikey: 296-21569-1-ND; Digikey Link: https://www.digikey.ca/product-detail/en/texas-instruments/TL5209DR/296-21569-1-ND/1427137; Price: 1.548 CAD; Rating: 500mA; Package: 8 SOIC

## Sheet MainBoard_USB.SchDoc
size B
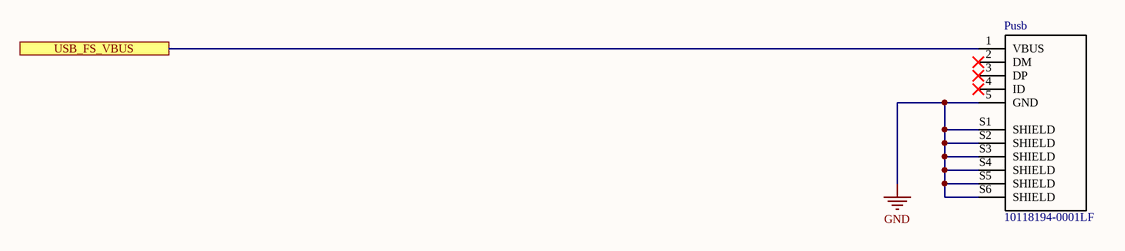
[diagram p4: MainBoard_USB.SchDoc]

### Parts
Pusb  10118194-0001LF  [USB Micro B Receptacle]

### Ports
USB_FS_VBUS

### Nets
GND: Pusb.5(GND) Pusb.S1(SHIELD) Pusb.S2(SHIELD) Pusb.S3(SHIELD) Pusb.S4(SHIELD) Pusb.S5(SHIELD) Pusb.S6(SHIELD)
NetF1_1: Pusb.1(VBUS) ; port USB_FS_VBUS

Not connected (* = marked no-connect by the designer): Pusb 2(DM)* 3(DP)* 4(ID)*

### Library data of the parts
Pusb = USB Micro B Receptacle: USB - micro B USB 2.0 Receptacle Connector 5 Position Surface Mount, Right Angle; Through Hole; MF: Amphenol ICC (FCI); Rating: 100VAC 1.8A; Digikey: 609-4618-1-ND; Digikey Link: https://www.digikey.ca/product-detail/en/amphenol-icc-fci/10118194-0001LF/609-4618-1-ND/2785382; MP: 10118194-0001LF; Price: 0.62000 CAD; ComponentLink1Description: Digikey; ComponentLink1URL: https://www.digikey.ca/product-detail/en/amphenol-icc-fci/10118194-0001LF/609-4618-1-ND/2785382; ComponentLink2Description: Datasheet; ComponentLink2URL: https://www.digikey.ca/en/datasheets/amphenol-fci/amphenol-fci-io-usb-micro

## Nets that join several sheets
3V3: MainBoard_Connectors (6 pins), MainBoard_144_IOs (6 pins), MainBoard_MCU_PWR (5 pins)
3V3_PER: MainBoard_Connectors (Prmii.11 Prmii.12 R22.1 R25.1), MainBoard_MCU_PWR (R15.1)
3V3_PWR_BRD: MainBoard_Connectors (J1.4 Ppwr.1), MainBoard_MCU_PWR (D8.A R28.2)
3V3_VDD: MainBoard_144_IOs (R21.1 U1.VDD33USB U3.5 U3.8), MainBoard_MCU_PWR (R10.2 R14.1)
5V: MainBoard_144_IOs (6 pins), MainBoard_MCU_PWR (D3.C D4.C)
5V_PWR_BRD: MainBoard_Connectors (J1.5 Ppwr.2), MainBoard_MCU_PWR (D4.A R17.2)
AGND: MainBoard_Connectors (Ppwr.3), MainBoard_144_IOs (U1.VSSA), MainBoard_MCU_PWR (5 pins)
GND: MainBoard_Connectors (23 pins), MainBoard_144_IOs (24 pins), MainBoard_MCU_PWR (28 pins), MainBoard_USB (7 pins)
MCU_VDD: MainBoard_144_IOs (U1.VDD), MainBoard_MCU_PWR (15 pins)
VBAT: MainBoard_144_IOs (U1.VBAT), MainBoard_MCU_PWR (C21.2 R9.1)
VCAP: MainBoard_144_IOs (U1.VCAP), MainBoard_MCU_PWR (C8.2 C9.2)
VCC: MainBoard_Connectors (J1.6), MainBoard_144_IOs (10 pins)
VDDA: MainBoard_144_IOs (U1.VDDA), MainBoard_MCU_PWR (5 pins)
VREF+: MainBoard_144_IOs (U1.VREF+), MainBoard_MCU_PWR (R8.1)
ADC1_INP2: MainBoard_Connectors (Um4.5), MainBoard_144_IOs (U1.PF11)
ADC1_INP5: MainBoard_Connectors (Um3.4), MainBoard_144_IOs (U1.PB1)
ADC1_INP6: MainBoard_Connectors (Um4.4), MainBoard_144_IOs (U1.PF12)
ADC1_INP9: MainBoard_Connectors (Um3.5), MainBoard_144_IOs (U1.PB0)
ADC2_INP2: MainBoard_Connectors (Um5.5), MainBoard_144_IOs (U1.PF13)
ADC2_INP3: MainBoard_Connectors (Um2.4), MainBoard_144_IOs (U1.PA6)
ADC2_INP6: MainBoard_Connectors (Um5.4), MainBoard_144_IOs (U1.PF14)
ADC3_INP1: MainBoard_Connectors (Um2.5), MainBoard_144_IOs (U1.PC3)
ADC3_INP2: MainBoard_Connectors (Um1.4), MainBoard_144_IOs (U1.PF9)
ADC3_INP3: MainBoard_Connectors (Um1.5), MainBoard_144_IOs (U1.PF7)
ETH_CRS_DV: MainBoard_Connectors (Prmii.8), MainBoard_144_IOs (U1.PA7)
ETH_MDC: MainBoard_Connectors (Prmii.10), MainBoard_144_IOs (U1.PC1)
ETH_MDIO: MainBoard_Connectors (Prmii.9), MainBoard_144_IOs (U1.PA2)
ETH_REF_CLK: MainBoard_Connectors (Prmii.7), MainBoard_144_IOs (U1.PA1)
ETH_RXD0: MainBoard_Connectors (Prmii.5), MainBoard_144_IOs (U1.PC4)
ETH_RXD1: MainBoard_Connectors (Prmii.6), MainBoard_144_IOs (U1.PC5)
ETH_TX_EN: MainBoard_Connectors (Prmii.3), MainBoard_144_IOs (U1.PB11)
ETH_TXD0: MainBoard_Connectors (Prmii.4), MainBoard_144_IOs (U1.PB12)
ETH_TXD1: MainBoard_Connectors (Prmii.1), MainBoard_144_IOs (U1.PB13)
JTCK-SWCLK: MainBoard_Connectors (Pjtag.6), MainBoard_144_IOs (U1.PA14)
JTDI: MainBoard_Connectors (Pjtag.10), MainBoard_144_IOs (U1.PA15)
JTDO_SWO: MainBoard_Connectors (Pjtag.8), MainBoard_144_IOs (U1.PB3)
NetF1_1: MainBoard_MCU_PWR (F1.1), MainBoard_USB (Pusb.1)
NRST: MainBoard_Connectors (Pjtag.12 Prmii.2), MainBoard_144_IOs (C30.2 S1.2 U1.NRST)
PB14: MainBoard_Connectors (R23.2), MainBoard_144_IOs (Pright.1 U1.PB14)
PE1: MainBoard_Connectors (R26.2), MainBoard_144_IOs (Ptop.2 U1.PE1)